# EasyEDA schematic SCH_m5_controller_2023-12-30.json
TITLE: Sheet_1; REV: 1.0; Date: 2023-12-30; Sheet: 1/1; Drawn By: dawidmt; Company: Your Company
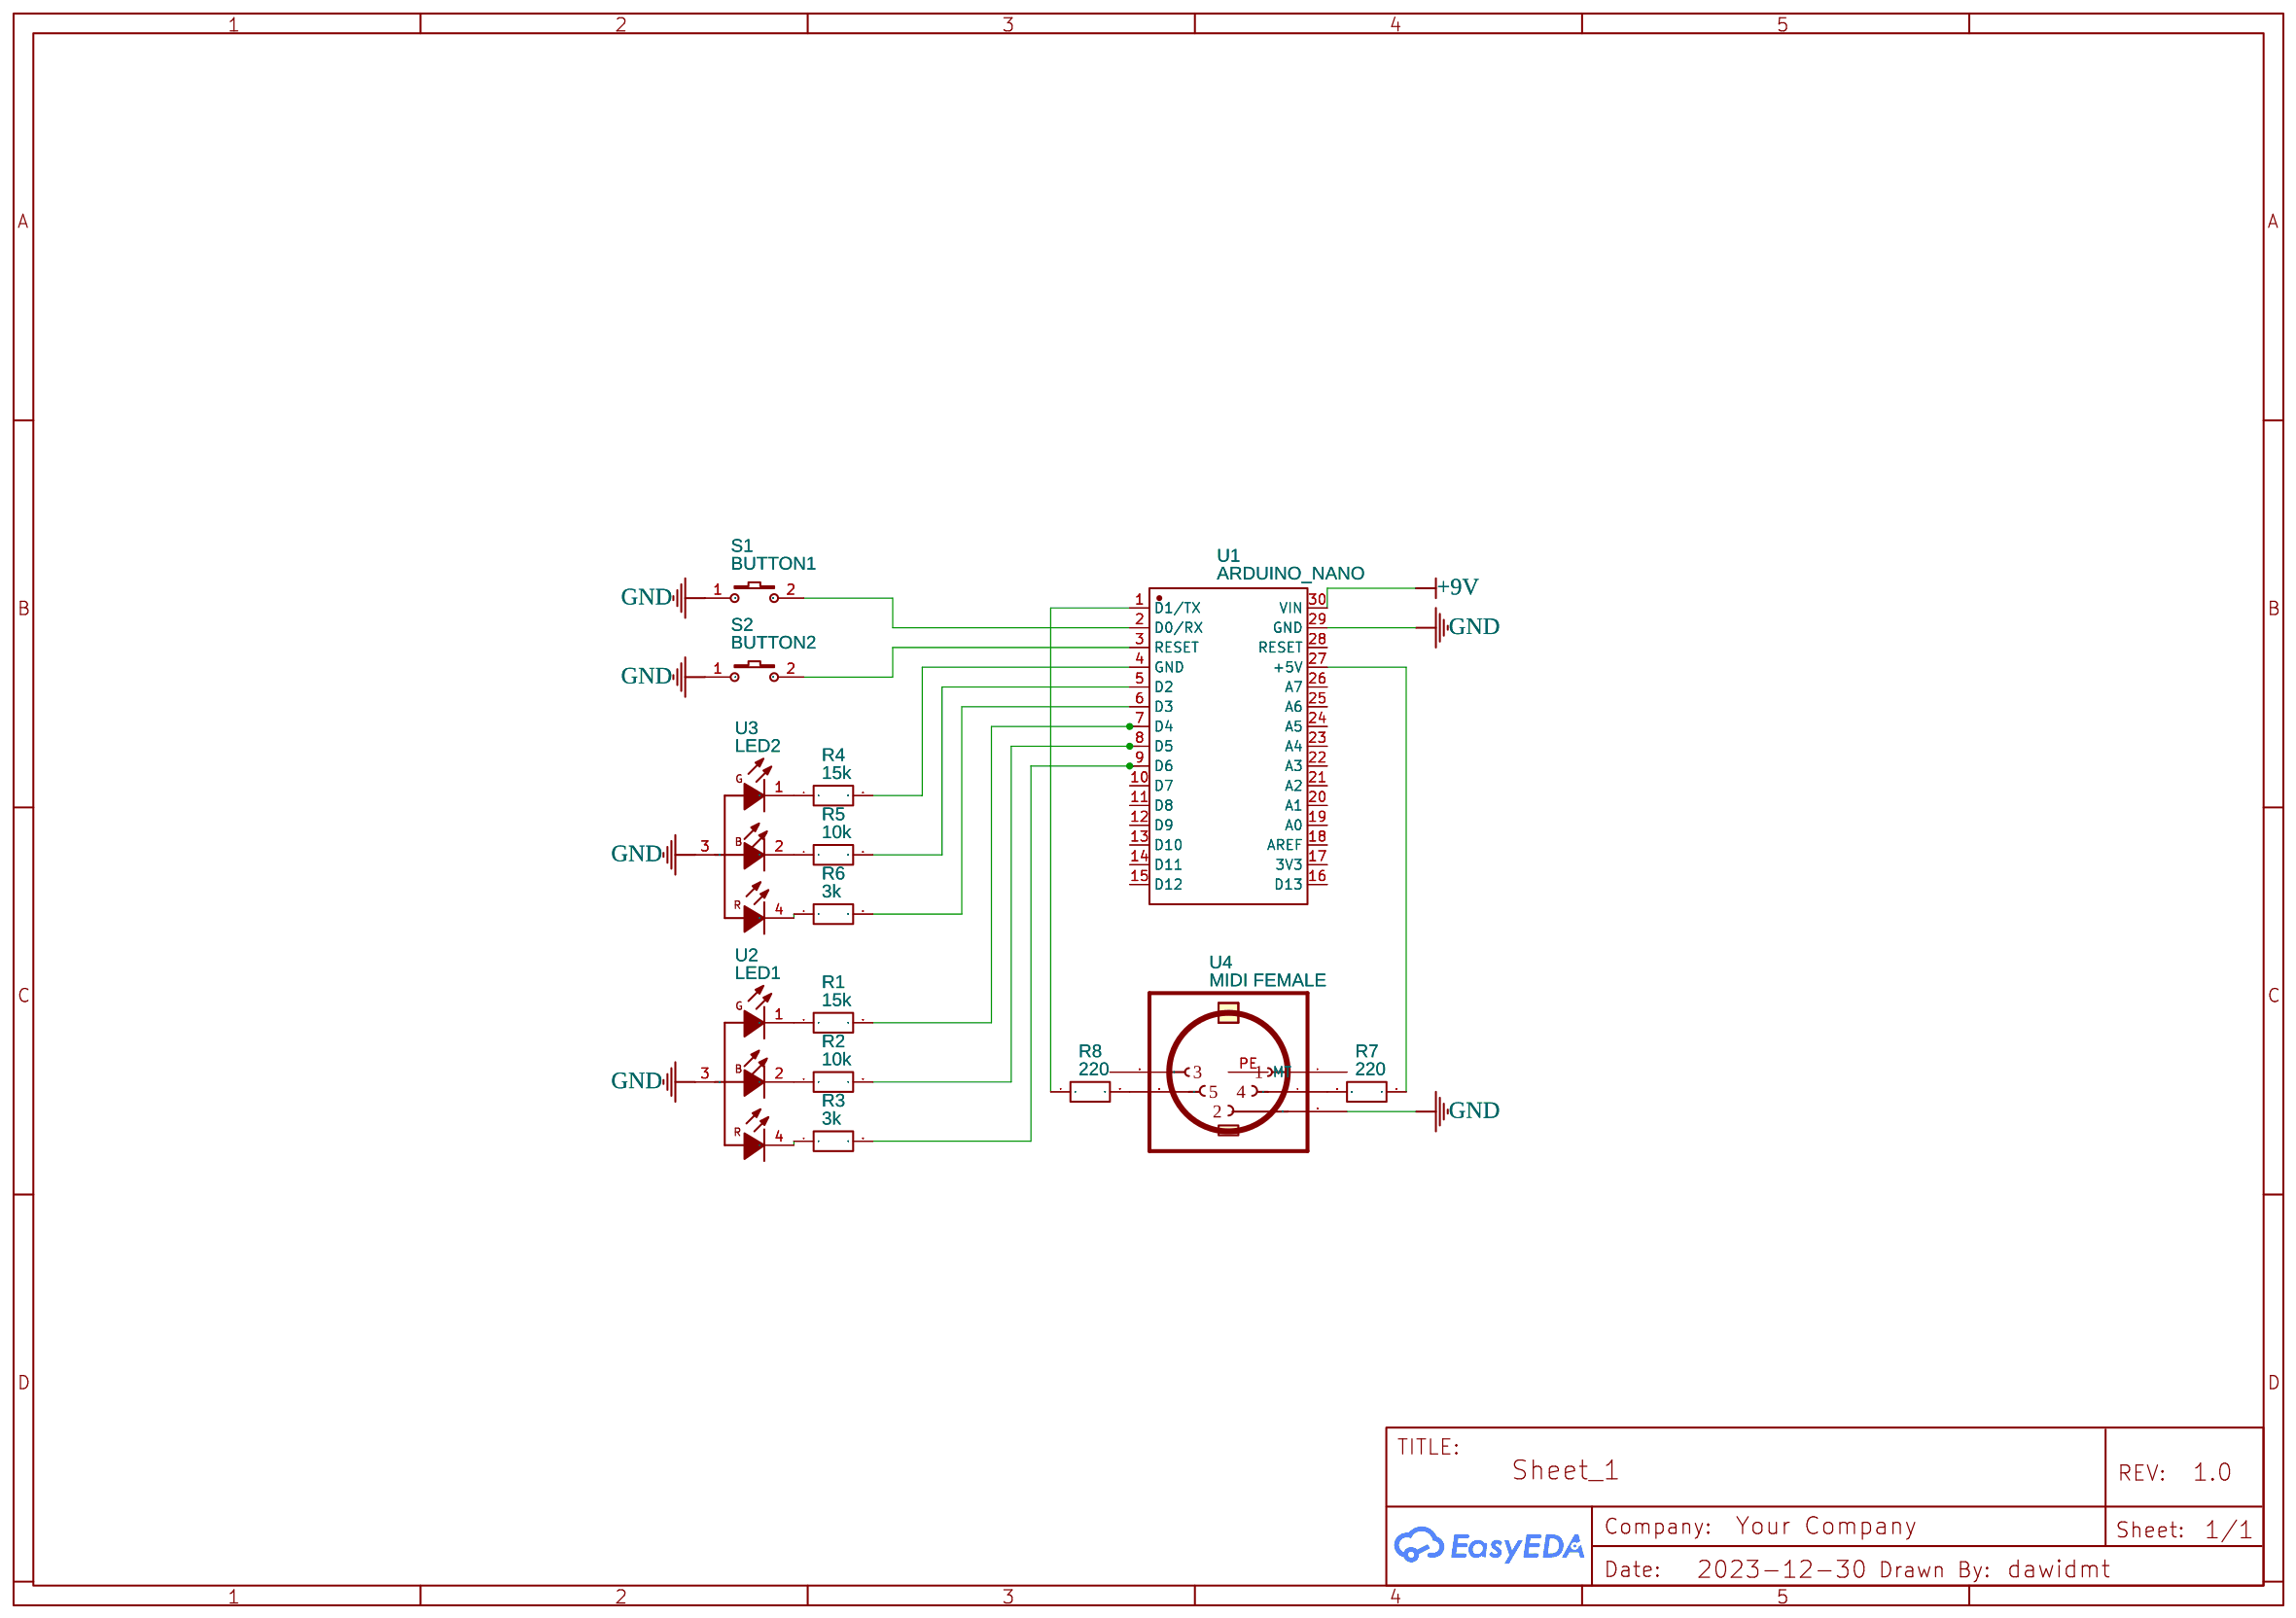
[diagram p0: schematic sheet]

## Parts
R1  15k  [R0603]
R2  10k  [R0603]
R3  3k  [R0603]
R4  15k  [R0603]
R5  10k  [R0603]
R6  3k  [R0603]
R7  220  [R0603]
R8  220  [R0603]
S1  BUTTON1  [KEY-SMD_2P-L6.2-W3.6-LS8.0]
S2  BUTTON2  [KEY-SMD_2P-L6.2-W3.6-LS8.0]
U1  ARDUINO_NANO  [COMM-TH_ARDUINO_NANO]
U2  LED1  [LED-SMD_GT-3806URGBC]
U3  LED2  [LED-SMD_GT-3806URGBC]
U4  MIDI FEMALE  [CP-2350]

## Library data of the parts
R1-R8 = R_0603_EU: Contributor: LCEDA_Lib
S1 S2 = K2-3.6×6.1_SMD: Supplier Part: C118141; Supplier: LCSC; Manufacturer Part: K2-1107ST-A4SW-06; Contributor: LCEDA_Lib; 制造商: 韩国韩荣
U1 = ARDUINO_NANO: Contributor: lcsc; Supplier: LCSC; Supplier Part: C9900017879; Manufacturer: null; JLCPCB Part Class: Extended Part
U2 U3 = GT-3806URGBC: Contributor: LCSC; Supplier: LCSC; Supplier Part: C2763903; Manufacturer: null; JLCPCB Part Class: Extended Part
U4 = MIDIJACK: Contributor: Adafruit; subpart_no: 3

## Nets
+9V: U1.30(VIN)
GND: S1.1 S2.1 U1.29(GND) U2.3 U3.3 U4.2
Net-(R1-1): R1.1 U2.1
Net-(R1-2): R1.2 U1.7(D4)
Net-(R2-1): R2.1 U2.2(1)
Net-(R2-2): R2.2 U1.8(D5)
Net-(R3-1): R3.1 U2.4
Net-(R3-2): R3.2 U1.9(D6)
Net-(R4-1): R4.1 U3.1
Net-(R4-2): R4.2 U1.4(GND)
Net-(R5-1): R5.1 U3.2(1)
Net-(R5-2): R5.2 U1.5(D2)
Net-(R6-1): R6.1 U3.4
Net-(R6-2): R6.2 U1.6(D3)
Net-(R7-1): R7.1 U1.27(+5V)
Net-(R7-2): R7.2 U4.4
Net-(R8-1): R8.1 U1.1(D1/TX)
Net-(R8-2): R8.2 U4.5
Net-(S1-2): S1.2 U1.2(D0/RX)
Net-(S2-2): S2.2 U1.3(RESET)

Not connected (* = marked no-connect by the designer): U1 10(D7) 11(D8) 12(D9) 13(D10) 14(D11) 15(D12) 16(D13) 17(3V3) 18(AREF) 19(A0) 20(A1) 21(A2) 22(A3) 23(A4) 24(A5) 25(A6) 26(A7) 28(RESET); U4 1 3 PE(MT)
